# EAGLE design esquematico_RLEG_groundplane_v3 (EAGLE 9.3.0)
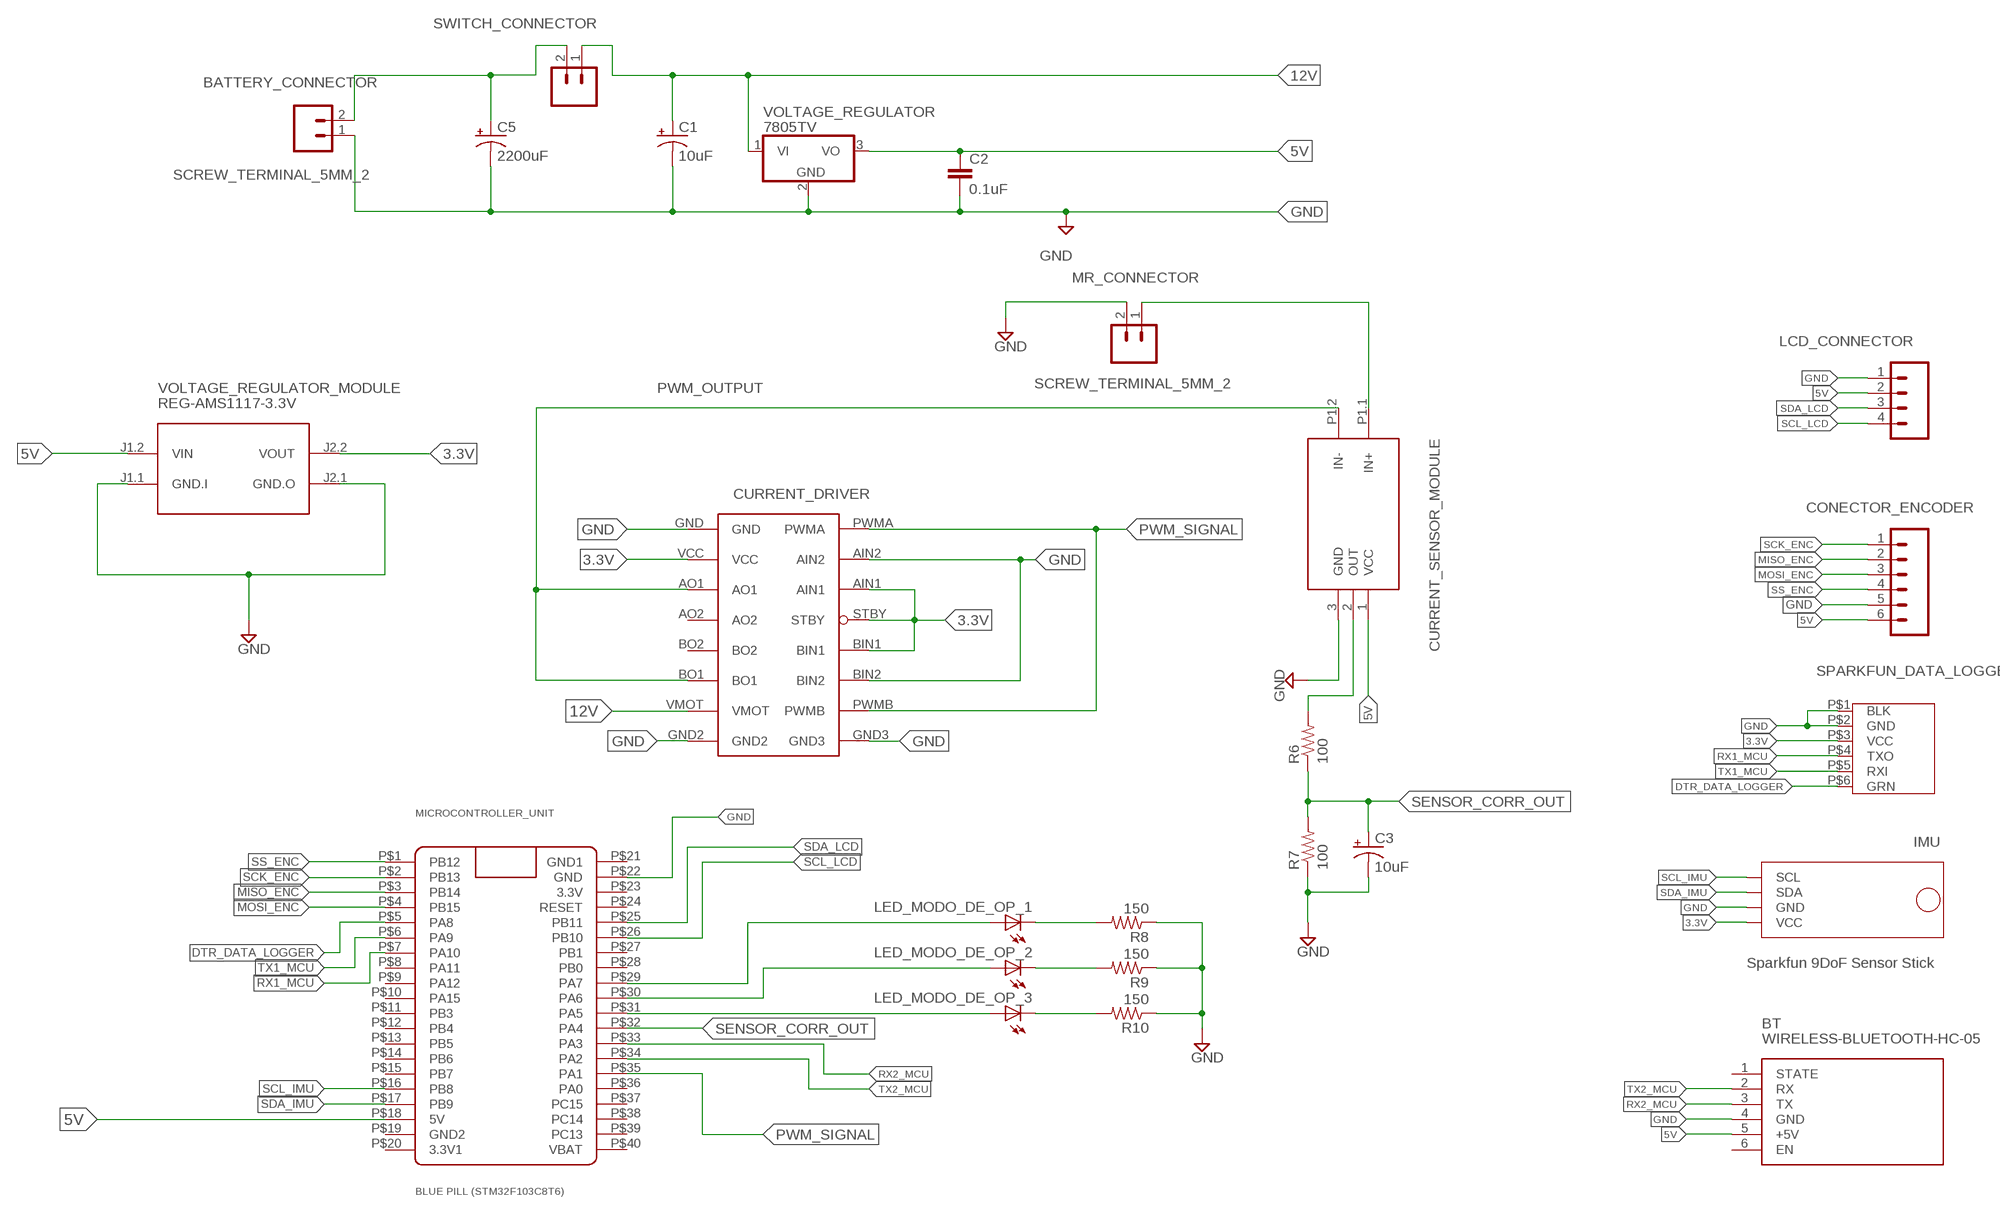
[diagram p0: schematic, sheet 1]

## Parts
BATTERY_CONNECTOR  SCREW_TERMINAL_5MM_2  CONN_025MM  [SCREWTERMINAL-5MM-2]
BT  WIRELESS-BLUETOOTH-HC-05  [WIRELESS-BLUETOOTH-HC-05]
C1  10uF  CPOL-USE5-5  [E5-5]
C2  0.1uF  C2.5/4  [C2.5-4]
C3  10uF  CPOL-USE5-5  [E5-5]
C5  2200uF  CPOL-USE5-13  [E5-13]
CONECTOR_ENCODER  a  CONN_06POLAR  [MOLEX-1X6]
CURRENT_DRIVER  TB6612FNG  [TB6612FNG]
CURRENT_SENSOR_MODULE  CURRENT-SENSOR-ACS712#IC  [CURRENT-SENSOR-ACS712#IC]
IMU  Sparkfun 9DoF Sensor Stick  IMU  [IMU]
LCD_CONNECTOR  CONN_04POLAR  [MOLEX-1X4]
LED_MODO_DE_OP_1  LED3MM  [LED3MM]
LED_MODO_DE_OP_2  LED3MM  [LED3MM]
LED_MODO_DE_OP_3  LED3MM  [LED3MM]
MICROCONTROLLER_UNIT  BLUE PILL (STM32F103C8T6)  BLUE_PILL  [BLUE_PILL]
MR_CONNECTOR  SCREW_TERMINAL_5MM_2  CONN_025MM  [SCREWTERMINAL-5MM-2]
R6  100  R-US_0207/9  [0207/9]
R7  100  R-US_0207/9  [0207/9]
R8  150  R-US_0207/9  [0207/9]
R9  150  R-US_0207/9  [0207/9]
R10  150  R-US_0207/9  [0207/9]
SPARKFUN_DATA_LOGGER  DATA_LOGGER  [DATA_LOGGER]
SWITCH_CONNECTOR  CONN_02POLAR  [MOLEX-1X2]
VOLTAGE_REGULATOR  7805TV  [TO220V]
VOLTAGE_REGULATOR_MODULE  REG-AMS1117-3.3V  [REG-AMS1117]

## Nets
3.3V: CURRENT_DRIVER.AIN1 CURRENT_DRIVER.BIN1 CURRENT_DRIVER.STBY CURRENT_DRIVER.VCC IMU.VCC SPARKFUN_DATA_LOGGER.P$3(VCC) VOLTAGE_REGULATOR_MODULE.J2.2(VOUT)
5V: BT.5(+5V) C2.1 CONECTOR_ENCODER.6 CURRENT_SENSOR_MODULE.1(VCC) LCD_CONNECTOR.2 MICROCONTROLLER_UNIT.P$18(5V) VOLTAGE_REGULATOR.3(VO) VOLTAGE_REGULATOR_MODULE.J1.2(VIN)
12V [power]: C1.+ CURRENT_DRIVER.VMOT SWITCH_CONNECTOR.1 VOLTAGE_REGULATOR.1(VI)
DTR_DATA_LOGGER: MICROCONTROLLER_UNIT.P$5(PA8) SPARKFUN_DATA_LOGGER.P$6(GRN)
GND [ground]: BATTERY_CONNECTOR.1 BT.4(GND) C1.- C2.2 C3.- C5.- CONECTOR_ENCODER.5 CURRENT_DRIVER.AIN2 CURRENT_DRIVER.BIN2 CURRENT_DRIVER.GND CURRENT_DRIVER.GND2 CURRENT_DRIVER.GND3 CURRENT_SENSOR_MODULE.3(GND) IMU.GND LCD_CONNECTOR.1 MICROCONTROLLER_UNIT.P$22(GND) MR_CONNECTOR.2 R7.1 R8.1 R9.1 R10.1 SPARKFUN_DATA_LOGGER.P$1(BLK) SPARKFUN_DATA_LOGGER.P$2(GND) VOLTAGE_REGULATOR.2(GND) VOLTAGE_REGULATOR_MODULE.J1.1(GND.I) VOLTAGE_REGULATOR_MODULE.J2.1(GND.O)
MISO_ENC: CONECTOR_ENCODER.2 MICROCONTROLLER_UNIT.P$3(PB14)
MOSI_ENC: CONECTOR_ENCODER.3 MICROCONTROLLER_UNIT.P$4(PB15)
N$1 [power]: CURRENT_SENSOR_MODULE.P1.1(IN+) MR_CONNECTOR.1
N$2 [power]: BATTERY_CONNECTOR.2 C5.+ SWITCH_CONNECTOR.2
N$3: LED_MODO_DE_OP_2.A MICROCONTROLLER_UNIT.P$30(PA6)
N$4: LED_MODO_DE_OP_1.A MICROCONTROLLER_UNIT.P$29(PA7)
N$7: LED_MODO_DE_OP_3.A MICROCONTROLLER_UNIT.P$31(PA5)
N$16: LED_MODO_DE_OP_1.K(C) R8.2
N$17: LED_MODO_DE_OP_2.K(C) R9.2
N$18: LED_MODO_DE_OP_3.K(C) R10.2
N$100: CURRENT_SENSOR_MODULE.2(OUT) R6.2
PWM_OUTPUT [power]: CURRENT_DRIVER.AO1 CURRENT_DRIVER.BO1 CURRENT_SENSOR_MODULE.P1.2(IN-)
PWM_SIGNAL: CURRENT_DRIVER.PWMA CURRENT_DRIVER.PWMB MICROCONTROLLER_UNIT.P$35(PA1)
RX1_MCU: MICROCONTROLLER_UNIT.P$7(PA10) SPARKFUN_DATA_LOGGER.P$4(TXO)
RX2_MCU: BT.3(TX) MICROCONTROLLER_UNIT.P$33(PA3)
SCK_ENC: CONECTOR_ENCODER.1 MICROCONTROLLER_UNIT.P$2(PB13)
SCL_IMU: IMU.SCL MICROCONTROLLER_UNIT.P$16(PB8)
SCL_LCD: LCD_CONNECTOR.4 MICROCONTROLLER_UNIT.P$26(PB10)
SDA_IMU: IMU.SDA MICROCONTROLLER_UNIT.P$17(PB9)
SDA_LCD: LCD_CONNECTOR.3 MICROCONTROLLER_UNIT.P$25(PB11)
SENSOR_CORR_OUT: C3.+ MICROCONTROLLER_UNIT.P$32(PA4) R6.1 R7.2
SS_ENC: CONECTOR_ENCODER.4 MICROCONTROLLER_UNIT.P$1(PB12)
TX1_MCU: MICROCONTROLLER_UNIT.P$6(PA9) SPARKFUN_DATA_LOGGER.P$5(RXI)
TX2_MCU: BT.2(RX) MICROCONTROLLER_UNIT.P$34(PA2)
Unconnected: BT.1(STATE) BT.6(EN) CURRENT_DRIVER.AO2 CURRENT_DRIVER.BO2 MICROCONTROLLER_UNIT.P$8(PA11) MICROCONTROLLER_UNIT.P$9(PA12) MICROCONTROLLER_UNIT.P$10(PA15) MICROCONTROLLER_UNIT.P$11(PB3) MICROCONTROLLER_UNIT.P$12(PB4) MICROCONTROLLER_UNIT.P$13(PB5) MICROCONTROLLER_UNIT.P$14(PB6) MICROCONTROLLER_UNIT.P$15(PB7) MICROCONTROLLER_UNIT.P$19(GND2) MICROCONTROLLER_UNIT.P$20(3.3V1) MICROCONTROLLER_UNIT.P$23(3.3V) MICROCONTROLLER_UNIT.P$24(RESET) MICROCONTROLLER_UNIT.P$27(PB1) MICROCONTROLLER_UNIT.P$28(PB0) MICROCONTROLLER_UNIT.P$36(PA0) MICROCONTROLLER_UNIT.P$37(PC15) MICROCONTROLLER_UNIT.P$38(PC14) MICROCONTROLLER_UNIT.P$39(PC13) MICROCONTROLLER_UNIT.P$40(VBAT)

## Power pins joined to a net without a drawn wire
GND1: MICROCONTROLLER_UNIT.P$21(GND1)

## Library data of the parts
BATTERY_CONNECTOR MR_CONNECTOR = SparkFun-Connectors:CONN_02: Multi connection point. Often used as Generic Header-pin footprint for 0.1 inch spaced/style header connections On any of the 0.1 inch spaced packages, you can populate with these: Break Away Headers - Straight <https://www.sparkfun.com/products/116> (PRT-00116) Break Away Male Headers - Right Angle <https://www.sparkfun.com/products/553> (PRT-00553) Female Headers <https://www.sparkfun.com/products/115> (PRT-00115) Break Away Headers - Machine Pin <https://www.sparkfun.com/products/117> (PRT-00117) Break Away Female Headers - Swiss Machine Pin <https://www.sparkfun.com/products/743> (PRT-00743) For SCREWTERMINALS and SPRING TERMINALS visit here: Screw Terimnals on SparkFun.com <https://www.sparkfun.com/search/results?term=Screw+Terminals> (5mm/3.5mm/2.54mm spacing) This device is also useful as a general connection point to wire up your design to another part of your project. Our various solder wires solder well into these plated through hole pads. Hook-Up Wire - Assortment (Stranded, 22 AWG) <https://www.sparkfun.com/products/11375> (PRT-11375) Hook-Up Wire - Assortment (Solid Core, 22 AWG) <https://www.sparkfun.com/products/11367> (PRT-11367) View the entire wire category on our website here <https://www.sparkfun.com/categories/141> Special notes: Molex polarized connector foot print use with: PRT-08233 with associated crimp pins and housings. 2.54_SCREWTERM for use with PRT-10571. 3.5mm Screw Terminal footprints for PRT-08084 5mm Screw Terminal footprints for use with PRT-08432; SF_SKU: PRT-08432
BT = diy-modules:WIRELESS-BLUETOOTH-HC-05: Bluetooth Transceiver Module based on HC-05 board Tutorial is available here: https://arduino-info.wikispaces.com/BlueTooth-HC05-HC06-Modules-How-To Click here to find device on ebay.com <http://www.ebay.com/sch/hc-05+module+rs232>
C1 C3 C5 = adafruit:CPOL-US: POLARIZED CAPACITOR, American symbol
C2 = capacitor-wima:C: CAPACITOR naming: grid - package width
CONECTOR_ENCODER = SparkFun-Connectors:CONN_06: Multi connection point. Often used as Generic Header-pin footprint for 0.1 inch spaced/style header connections On any of the 0.1 inch spaced packages, you can populate with these: Break Away Headers - Straight <https://www.sparkfun.com/products/116> (PRT-00116) Break Away Male Headers - Right Angle <https://www.sparkfun.com/products/553> (PRT-00553) Female Headers <https://www.sparkfun.com/products/115> (PRT-00115) Break Away Headers - Machine Pin <https://www.sparkfun.com/products/117> (PRT-00117) Break Away Female Headers - Swiss Machine Pin <https://www.sparkfun.com/products/743> (PRT-00743) Arduino Stackable Header - 6 Pin <https://www.sparkfun.com/products/9280> (PRT-09280) For SCREWTERMINALS and SPRING TERMINALS visit here: Screw Terimnals on SparkFun.com <https://www.sparkfun.com/search/results?term=Screw+Terminals> (5mm/3.5mm/2.54mm spacing) This device is also useful as a general connection point to wire up your design to another part of your project. Our various solder wires solder well into these plated through hole pads. Hook-Up Wire - Assortment (Stranded, 22 AWG) <https://www.sparkfun.com/products/11375> (PRT-11375) Hook-Up Wire - Assortment (Solid Core, 22 AWG) <https://www.sparkfun.com/products/11367> (PRT-11367) View the entire wire category on our website here <https://www.sparkfun.com/categories/141>
CURRENT_DRIVER = TB6612FNG:TB6612FNG
CURRENT_SENSOR_MODULE = RLEG-peripheral-devices:CURRENT-SENSOR-ACS712#IC: Isolated Bipolar Current Sensors based on ACS712 chip Symbol with input pins More details available here: http://embedded-lab.com/blog/a-brief-overview-of-allegro-acs712-current-sensor-part-1/ Click here to find device on ebay.com <http://www.ebay.com/sch/acs712+module> Note: There are many available versions with different pinout. Please check before use
IMU = RLEG-sparkfun:IMU: SparkFun 9 Degrees of Freedom - Sensor Stick (Retired SEN-10724)
LCD_CONNECTOR = SparkFun-Connectors:CONN_04: Multi connection point. Often used as Generic Header-pin footprint for 0.1 inch spaced/style header connections On any of the 0.1 inch spaced packages, you can populate with these: Break Away Headers - Straight <https://www.sparkfun.com/products/116> (PRT-00116) Break Away Male Headers - Right Angle <https://www.sparkfun.com/products/553> (PRT-00553) Female Headers <https://www.sparkfun.com/products/115> (PRT-00115) Break Away Headers - Machine Pin <https://www.sparkfun.com/products/117> (PRT-00117) Break Away Female Headers - Swiss Machine Pin <https://www.sparkfun.com/products/743> (PRT-00743) For SCREWTERMINALS and SPRING TERMINALS visit here: Screw Terimnals on SparkFun.com <https://www.sparkfun.com/search/results?term=Screw+Terminals> (5mm/3.5mm/2.54mm spacing) This device is also useful as a general connection point to wire up your design to another part of your project. Our various solder wires solder well into these plated through hole pads. Hook-Up Wire - Assortment (Stranded, 22 AWG) <https://www.sparkfun.com/products/11375> (PRT-11375) Hook-Up Wire - Assortment (Solid Core, 22 AWG) <https://www.sparkfun.com/products/11367> (PRT-11367) View the entire wire category on our website here <https://www.sparkfun.com/categories/141> Special notes: Molex polarized connector foot print use with SKU : PRT-08231 with associated crimp pins and housings. 1MM SMD Version SKU: PRT-10208; PROD_ID: CONN-08186; SF_ID: PRT-08231
LED_MODO_DE_OP_1-LED_MODO_DE_OP_3 = adafruit:LED: LED OSRAM: - CHIPLED LG R971, LG N971, LY N971, LG Q971, LY Q971, LO R971, LY R971 LH N974, LH R974 LS Q976, LO Q976, LY Q976 LO Q996 - Hyper CHIPLED LW Q18S LB Q993, LB Q99A, LB R99A - SideLED LS A670, LO A670, LY A670, LG A670, LP A670 LB A673, LV A673, LT A673, LW A673 LH A674 LY A675 LS A676, LA A676, LO A676, LY A676, LW A676 LS A679, LY A679, LG A679 - Hyper Micro SIDELED® LS Y876, LA Y876, LO Y876, LY Y876 LT Y87S - SmartLED LW L88C, LW L88S LB L89C, LB L89S, LG L890 LS L89K, LO L89K, LY L89K LS L896, LA L896, LO L896, LY L896 - TOPLED LS T670, LO T670, LY T670, LG T670, LP T670 LSG T670, LSP T670, LSY T670, LOP T670, LYG T670 LG T671, LOG T671, LSG T671 LB T673, LV T673, LT T673, LW T673 LH T674 LS T676, LA T676, LO T676, LY T676, LB T676, LH T676, LSB T676, LW T676 LB T67C, LV T67C, LT T67C, LS T67K, LO T67K, LY T67K, LW E67C LS E67B, LA E67B, LO E67B, LY E67B, LB E67C, LV E67C, LT E67C LW T67C LS T679, LY T679, LG T679 LS T770, LO T770, LY T770, LG T770, LP T770 LB T773, LV T773, LT T773, LW T773 LH T774 LS E675, LA E675, LY E675, LS T675 LS T776, LA T776, LO T776, LY T776, LB T776 LHGB T686 LT T68C, LB T68C - Hyper Mini TOPLED® LB M676 - Mini TOPLED Santana® LG M470 LS M47K, LO M47K, LY M47K Source: http://www.osram.convergy.de/
MICROCONTROLLER_UNIT = BluePill:BLUE_PILL
R6-R10 = adafruit:R-US_: RESISTOR, American symbol
SPARKFUN_DATA_LOGGER = RLEG-sparkfun:DATA_LOGGER
SWITCH_CONNECTOR = SparkFun-Connectors:CONN_02: Multi connection point. Often used as Generic Header-pin footprint for 0.1 inch spaced/style header connections On any of the 0.1 inch spaced packages, you can populate with these: Break Away Headers - Straight <https://www.sparkfun.com/products/116> (PRT-00116) Break Away Male Headers - Right Angle <https://www.sparkfun.com/products/553> (PRT-00553) Female Headers <https://www.sparkfun.com/products/115> (PRT-00115) Break Away Headers - Machine Pin <https://www.sparkfun.com/products/117> (PRT-00117) Break Away Female Headers - Swiss Machine Pin <https://www.sparkfun.com/products/743> (PRT-00743) For SCREWTERMINALS and SPRING TERMINALS visit here: Screw Terimnals on SparkFun.com <https://www.sparkfun.com/search/results?term=Screw+Terminals> (5mm/3.5mm/2.54mm spacing) This device is also useful as a general connection point to wire up your design to another part of your project. Our various solder wires solder well into these plated through hole pads. Hook-Up Wire - Assortment (Stranded, 22 AWG) <https://www.sparkfun.com/products/11375> (PRT-11375) Hook-Up Wire - Assortment (Solid Core, 22 AWG) <https://www.sparkfun.com/products/11367> (PRT-11367) View the entire wire category on our website here <https://www.sparkfun.com/categories/141> Special notes: Molex polarized connector foot print use with: PRT-08233 with associated crimp pins and housings. 2.54_SCREWTERM for use with PRT-10571. 3.5mm Screw Terminal footprints for PRT-08084 5mm Screw Terminal footprints for use with PRT-08432; SF_ID: PRT-09918
VOLTAGE_REGULATOR = linear:78*: Positive VOLTAGE REGULATOR Source: http://cache.national.com/ds/LM/LM78L05.pdf http://www.fairchildsemi.com/ds/LM/LM7805.pdf
VOLTAGE_REGULATOR_MODULE = diy-modules:REG-AMS1117-*: Linear Regulator based on AMS1117 chip

## Net classes
0 default: width 1 mm, drill 0.2 mm, clearance 0.5 mm
1 power: width 1.5 mm, drill 0.2 mm, clearance 1 mm
2 ground: width 1.5 mm, drill 0.2 mm, clearance 1 mm

## Board
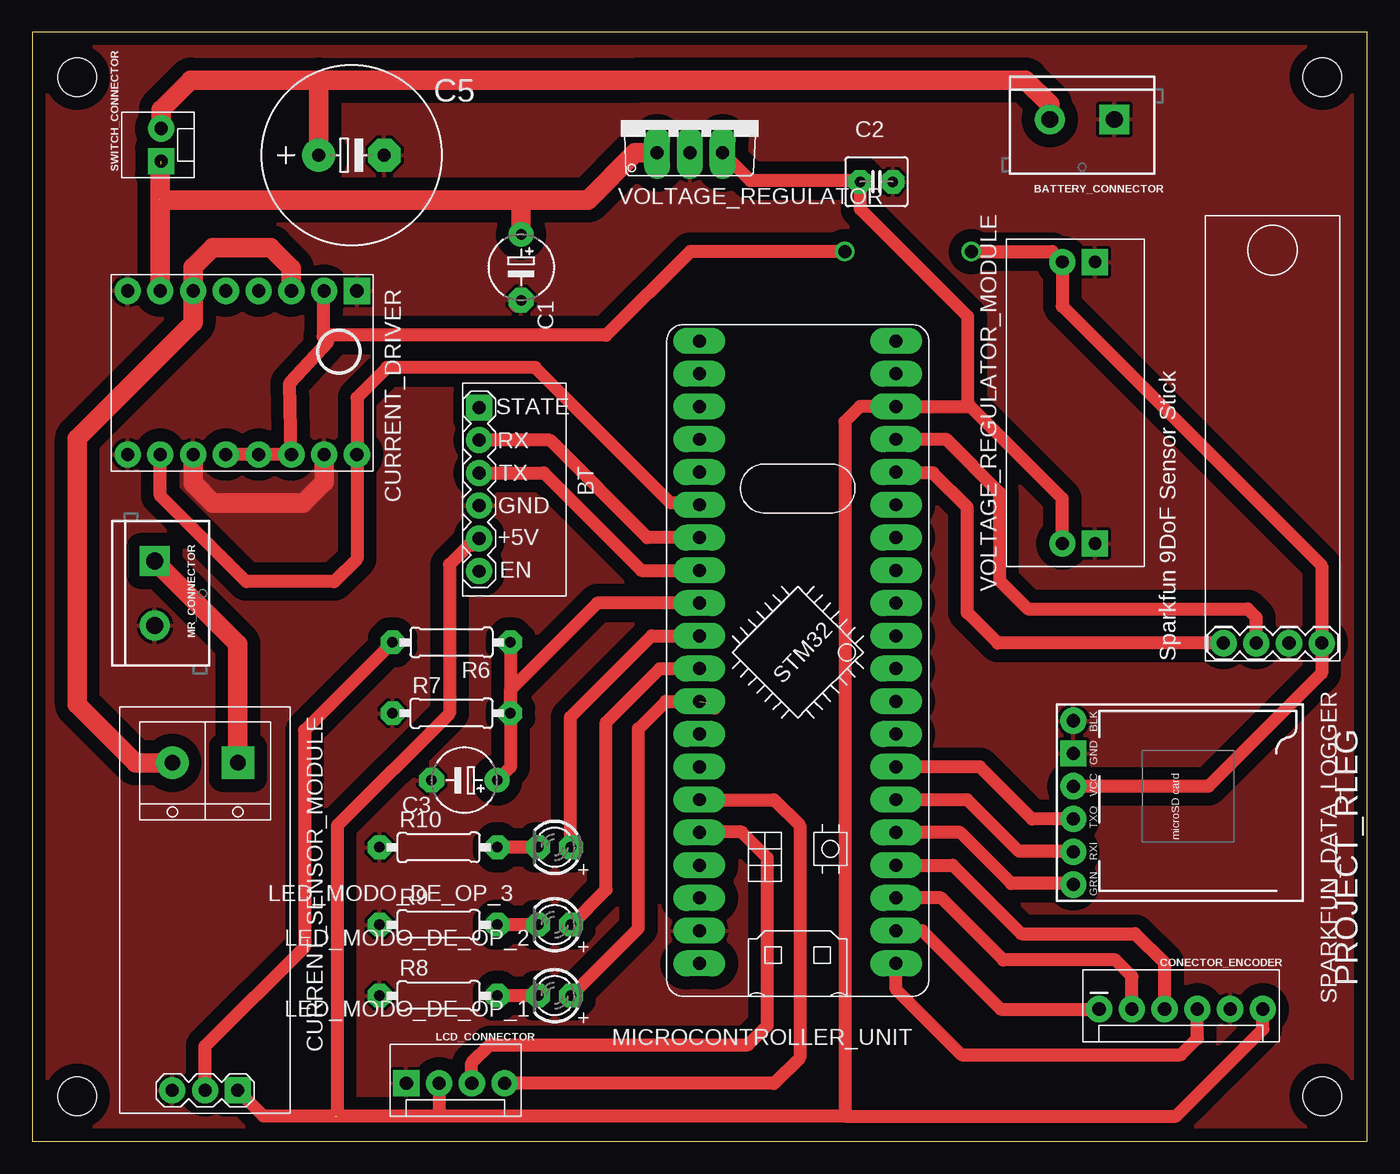
[diagram p1: board, top side]
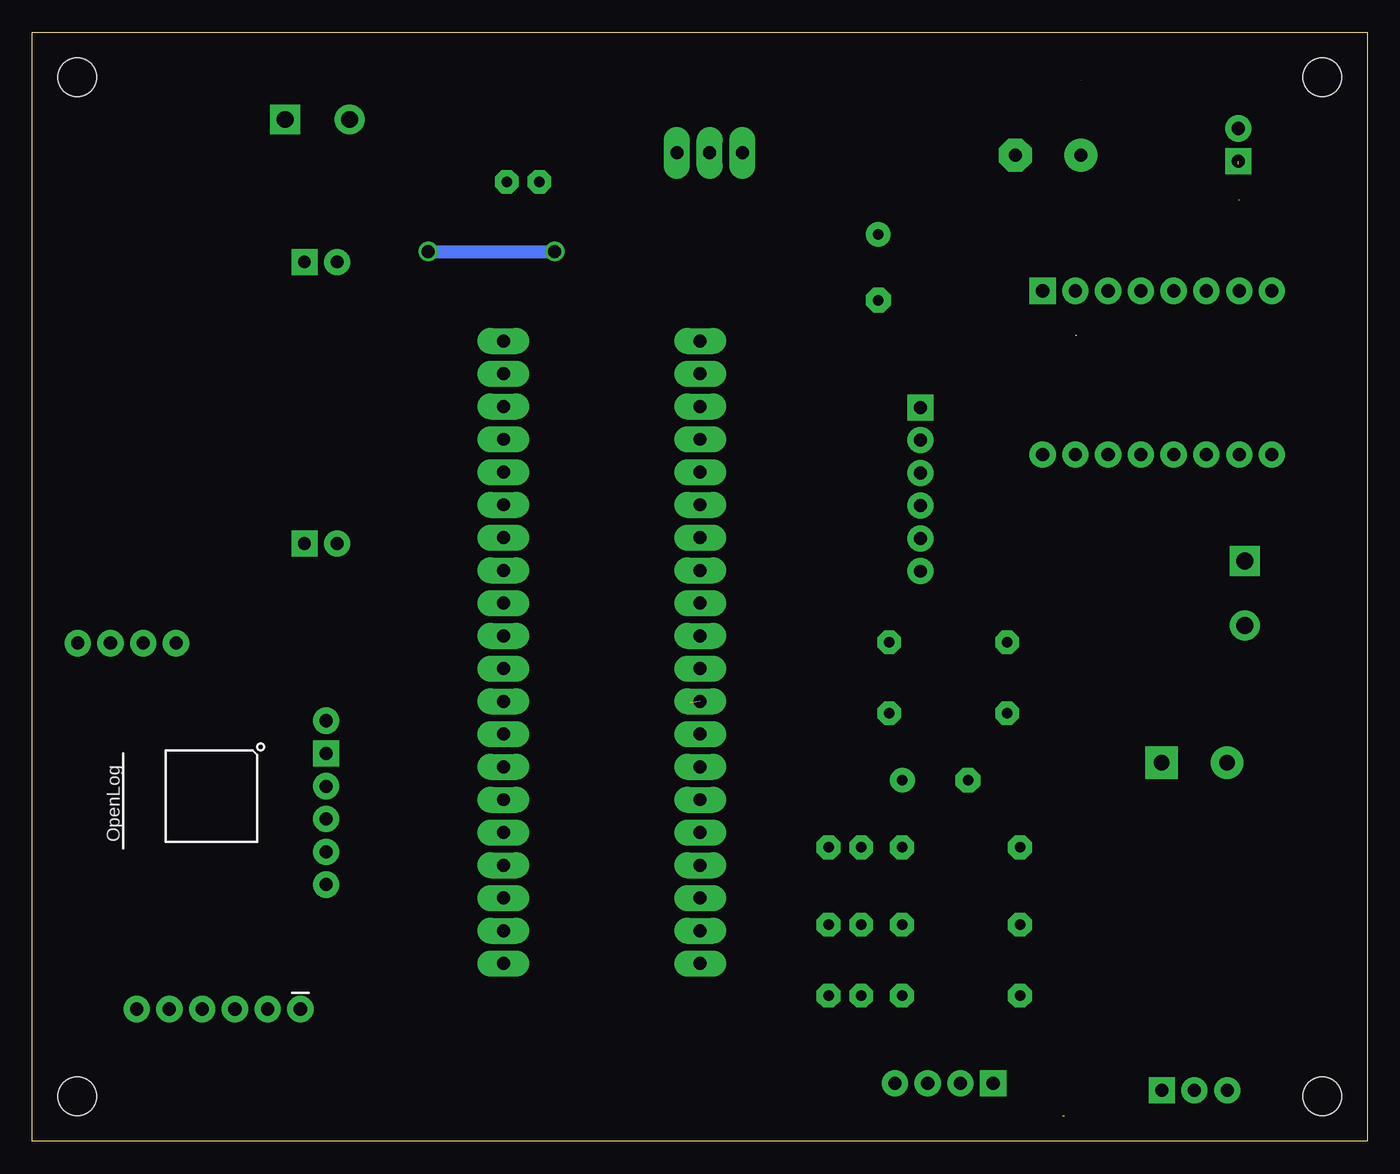
[diagram p2: board, bottom side, seen from below]

Size 103.5 x 86 mm. Coordinates in mm from the lower left corner, seen from the top.
Outline: 0,0 103.5,0 103.5,86 0,86 0,0
Copper layers (1*16): Top 0.035mm / dielectric 1.5mm / Bottom 0.035mm
Design rules "default *": minimum track width 6mil, minimum drill 0.5mm, track to track 6mil, track to pad 6mil, pad to pad 6mil, via to via 6mil, smd to smd 6mil, copper to edge 40mil, drill to drill 6mil, minimum pad ring 20mil, minimum via ring 8mil, stop-mask expansion 4mil, vias tented up to drill 0mil, thermal gap 10mil
Holes 3 mm at 100,3.5 100,82.5 3.5,82.5 3.5,3.5

### Footprints (pad centres in the part's own frame; a part is rotated, then mirrored left to right if it is on the bottom)
SCREWTERMINAL-5MM-2 = drill 1.3 pad 2.032 square: 1 0,0 | drill 1.3 pad 2.032: 2 5,0
WIRELESS-BLUETOOTH-HC-05 = drill 1 square: 1 -4.07,-5.025 | drill 1: 2 -1.53,-5.025; 3 1.01,-5.025; 4 3.55,-5.025; 5 6.09,-5.025; 6 8.63,-5.025
E5-5 = drill 0.813 pad 1.905: + -2.54,0 | drill 0.813 pad 1.905 octagon: - 2.54,0
C2.5-4 = drill 0.813 pad 1.6 octagon: 1 -1.27,0; 2 1.27,0
E5-13 = drill 1.016 pad 2.54: + -2.54,0 | drill 1.016 pad 2.54 octagon: - 2.54,0
MOLEX-1X6 = drill 1.016 pad 1.88: 1 0,0; 2 2.54,0; 3 5.08,0; 4 7.62,0; 5 10.16,0; 6 12.7,0
TB6612FNG = drill 1.016 pad 1.676: AIN1 13.97,13.97; AIN2 13.97,16.51; AO1 1.27,13.97; AO2 1.27,11.43; BIN1 13.97,8.89; BIN2 13.97,6.35; BO1 1.27,6.35; BO2 1.27,8.89; GND2 1.27,1.27; GND3 13.97,1.27; PWMA 13.97,19.05; PWMB 13.97,3.81; STBY 13.97,11.43; VCC 1.27,16.51; VMOT 1.27,3.81 | drill 1.016 pad 1.676 square: GND 1.27,19.05
CURRENT-SENSOR-ACS712#IC = drill 1 square: 1 13.97,2.54 | drill 1: 2 13.97,0; 3 13.97,-2.54 | drill 1.2 pad 2.5 square: P1.1 -11.43,2.54 | drill 1.2 pad 2.5: P1.2 -11.43,-2.54
IMU = drill 1.016 pad 1.88: GND 1.397,3.937; SCL 1.397,9.017; SDA 1.397,6.477; VCC 1.397,1.397
MOLEX-1X4 = drill 1.016 pad 1.88 square: 1 0,0 | drill 1.016 pad 1.88: 2 2.54,0; 3 5.08,0; 4 7.62,0
LED3MM = drill 0.813 pad 1.676 octagon: A -1.27,0; K 1.27,0
BLUE_PILL = drill 1 long: P$1 -7.62,15.24; P$2 -7.62,12.7; P$3 -7.62,10.16; P$4 -7.62,7.62; P$5 -7.62,5.08; P$6 -7.62,2.54; P$7 -7.62,0; P$8 -7.62,-2.54; P$9 -7.62,-5.08; P$10 -7.62,-7.62; P$11 -7.62,-10.16; P$12 -7.62,-12.7; P$13 -7.62,-15.24; P$14 -7.62,-17.78; P$15 -7.62,-20.32; P$16 -7.62,-22.86; P$17 -7.62,-25.4; P$18 -7.62,-27.94; P$19 -7.62,-30.48; P$20 -7.62,-33.02; P$21 7.62,15.24; P$22 7.62,12.7; P$23 7.62,10.16; P$24 7.62,7.62; P$25 7.62,5.08; P$26 7.62,2.54; P$27 7.62,0; P$28 7.62,-2.54; P$29 7.62,-5.08; P$30 7.62,-7.62; P$31 7.62,-10.16; P$32 7.62,-12.7; P$33 7.62,-15.24; P$34 7.62,-17.78; P$35 7.62,-20.32; P$36 7.62,-22.86; P$37 7.62,-25.4; P$38 7.62,-27.94; P$39 7.62,-30.48; P$40 7.62,-33.02
0207/9 = drill 0.813 pad 1.676 octagon: 1 -4.572,0; 2 4.572,0
DATA_LOGGER = drill 1.016 pad 1.905: P$1 1.27,1.27; P$3 6.35,1.27; P$4 8.89,1.27; P$5 11.43,1.27; P$6 13.97,1.27 | drill 1.016 pad 1.905 square: P$2 3.81,1.27
MOLEX-1X2 = drill 1.016 pad 1.88 square: 1 0,0 | drill 1.016 pad 1.88: 2 2.54,0
TO220V = drill 1.016 long: 1 -2.54,-2.54; 2 0,-2.54; 3 2.54,-2.54
REG-AMS1117 = drill 1 square: J1.1 -10.922,-1.27; J2.1 10.922,-1.27 | drill 1: J1.2 -10.922,1.27; J2.2 10.922,1.27

### Placement (x,y rotation side)
BATTERY_CONNECTOR  83.89,79.24 180 top
BT  39.68,52.84 270 top
C1  37.9,67.77 270 top
C2  65.45,74.41 0 top
C3  33.5,28 180 top
C5  24.75,76.47 0 top
CONECTOR_ENCODER  82.71,10.26 0 top
CURRENT_DRIVER  6.12,67.22 270 top
CURRENT_SENSOR_MODULE  13.4,17.93 270 top
IMU  101.37,37.24 90 top
LCD_CONNECTOR  29,4.5 0 top
LED_MODO_DE_OP_1  40.5,11.3 180 top
LED_MODO_DE_OP_2  40.5,16.8 180 top
LED_MODO_DE_OP_3  40.5,22.8 180 top
MICROCONTROLLER_UNIT  59.35,29.04 180 top
MR_CONNECTOR  9.5,45 270 top
R6  32.5,38.7 180 top
R7  32.5,33.2 0 top
R8  31.5,11.3 0 top
R9  31.5,16.8 0 top
R10  31.5,22.8 0 top
SPARKFUN_DATA_LOGGER  79.44,33.89 270 top
SWITCH_CONNECTOR  10,76 90 top
VOLTAGE_REGULATOR  50.98,79.19 0 top
VOLTAGE_REGULATOR_MODULE  81.13,57.27 90 top

### Tracks (layer width: path | path; a pad name or v marks a point on that pad's centre or on a via)
3.3V  (via drill 1)  (2 unrouted)
  Top 1: CURRENT_DRIVER.BIN1 CURRENT_DRIVER.STBY CURRENT_DRIVER.AIN1 19.96,58.81 22.93,62.03 22.53,62.43 | v72.8,69 79.05,69 VOLTAGE_REGULATOR_MODULE.J2.2 79.86,64.75 99.97,44.64 IMU.VCC 99.97,36.32 91.19,27.54 SPARKFUN_DATA_LOGGER.P$3 | CURRENT_DRIVER.VCC 22.6,65.92 22.6,62.5 44.5,62.5 51,69 v63,69
  Bottom 1: v72.8,69 v63,69
5V  (1 unrouted)
  Top 1: CONECTOR_ENCODER.6 95.41,8.71 88.66,1.96 63,1.96 | VOLTAGE_REGULATOR_MODULE.J1.2 79.86,49.85 72.73,56.98 72.53,56.98 | 72.53,56.98 72.53,63.97 64.18,72.32 C2.1 64.09,74.5 55.67,74.5 VOLTAGE_REGULATOR.3 | 63,1.96 63,55.8 64.18,56.98 MICROCONTROLLER_UNIT.P$18 72.53,56.98 | 63,1.96 31.5,1.96 | 31.5,1.96 23.64,1.96 23.64,24.5 32.34,33.2 32.34,44.74 33.82,46.22 34.12,46.22 BT.5 | 23.5,1.96 17.94,1.96 CURRENT_SENSOR_MODULE.1 | LCD_CONNECTOR.2 31.54,2 31.5,1.96
12V  (2 unrouted)
  Top 1.5: 37.71,73 9.93,73 | VOLTAGE_REGULATOR.1 46.74,76.65 43.09,73 37.71,73 | CURRENT_DRIVER.VMOT 9.93,73 | C1.+ 37.9,72.81 37.71,73 | 9.93,73 10,73.07 | 9.93,73 9.93,75.7 10,75.77
DTR_DATA_LOGGER
  Top 1: SPARKFUN_DATA_LOGGER.P$6 80.63,20 75.9,20 71.94,23.96 MICROCONTROLLER_UNIT.P$5
GND
  Top 1.5: CURRENT_DRIVER.BIN2 12.47,51.03 14,49.5 21,49.5 22.63,51.13 CURRENT_DRIVER.AIN2 | 37.67,65 C1.-
  pour Top: 0,0 103.5,0 103.5,86 0,86
MISO_ENC
  Top 1: CONECTOR_ENCODER.2 85.25,12.8 83.98,14.07 75.28,14.07 70.47,18.88 MICROCONTROLLER_UNIT.P$3
MOSI_ENC
  Top 1: MICROCONTROLLER_UNIT.P$4 71.36,21.42 76.67,16.11 85.52,16.11 87.79,13.84 CONECTOR_ENCODER.3
N$1
  Top 1.5: CURRENT_SENSOR_MODULE.P1.1 15.94,38.56 MR_CONNECTOR.1
N$2  (2 unrouted)
  Top 1.5: 22.21,82.3 47,82.3 77.01,82.3 78.89,80.41 BATTERY_CONNECTOR.2 | 22.21,82.3 C5.+ | SWITCH_CONNECTOR.2 10,80 12.3,82.3 22.21,82.3
N$3
  Top 1: LED_MODO_DE_OP_2.A 44.5,19.53 44.5,32.5 48.66,36.66 MICROCONTROLLER_UNIT.P$30
N$4  (1 unrouted)
  Top 1: 52.91,33.59 52.5,34 | LED_MODO_DE_OP_1.A 47,16.53 47,32 49.12,34.12 MICROCONTROLLER_UNIT.P$29
N$7
  Top 1: MICROCONTROLLER_UNIT.P$31 48.02,39.2 41.7,32.88 41.7,22.87 LED_MODO_DE_OP_3.A
N$16
  Top 1: LED_MODO_DE_OP_1.K R8.2
N$17
  Top 1: LED_MODO_DE_OP_2.K R9.2
N$18
  Top 1: LED_MODO_DE_OP_3.K R10.2
N$100
  Top 1: R6.2 21.1,31.87 21.1,15.1 13.4,7.4 CURRENT_SENSOR_MODULE.2
PWM_OUTPUT
  Top 1.5: CURRENT_DRIVER.AO1 20.09,67.71 18.5,69.3 14,69.3 12.47,67.77 CURRENT_DRIVER.BO1 12.47,63.47 3.5,54.5 3.5,33.87 8.01,29.36 CURRENT_SENSOR_MODULE.P1.2
PWM_SIGNAL
  Top 1: CURRENT_DRIVER.PWMB 9.93,50.07 16.6,43.4 23.4,43.4 25.17,45.17 CURRENT_DRIVER.PWMA 25.17,57.67 27.5,60 39,60 49.5,49.5 51.59,49.5 MICROCONTROLLER_UNIT.P$35
RX1_MCU
  Top 1: SPARKFUN_DATA_LOGGER.P$4 77.5,25 73.46,29.04 MICROCONTROLLER_UNIT.P$7
RX2_MCU
  Top 1: BT.3 39.67,51.83 47.22,44.28 MICROCONTROLLER_UNIT.P$33
SCK_ENC  (1 unrouted)
  Top 1: CONECTOR_ENCODER.1 75.09,10.26 69.05,16.3 69.01,16.34 MICROCONTROLLER_UNIT.P$2
SCL_IMU
  Top 1: IMU.SCL 74.86,38.64 72.5,41 72.5,49.18 69.84,51.84 67.03,51.84 MICROCONTROLLER_UNIT.P$16
SCL_LCD
  Top 1: MICROCONTROLLER_UNIT.P$26 57.5,26.5 59.5,24.5 59.5,6.5 57.5,4.5 LCD_CONNECTOR.4
SDA_IMU
  Top 1: IMU.SDA 94.89,40.64 94.23,41.3 77.2,41.3 75,43.5 75,50.3 70.86,54.44 MICROCONTROLLER_UNIT.P$17
SDA_LCD
  Top 1: LCD_CONNECTOR.3 34.08,6.08 35.5,7.5 55.5,7.5 57,9 57,22 55,24 51.77,24 MICROCONTROLLER_UNIT.P$25
SENSOR_CORR_OUT
  Top 1: MICROCONTROLLER_UNIT.P$32 43.81,41.74 37.07,35 R7.2 | R6.1 R7.2 | R7.2 37.07,29.03 C3.+
SS_ENC
  Top 1: MICROCONTROLLER_UNIT.P$1 66.97,11.8 72.05,6.72 89.06,6.72 90.33,7.99 CONECTOR_ENCODER.4
TX1_MCU
  Top 1: SPARKFUN_DATA_LOGGER.P$5 80.67,22.5 76.5,22.5 72.5,26.5 MICROCONTROLLER_UNIT.P$6
TX2_MCU
  Top 1: MICROCONTROLLER_UNIT.P$34 47.68,46.82 40.13,54.37 BT.2

### Text on the board
tPlace: PROJECT_RLEG